# EAGLE schematic simple (EAGLE 7.7.0)
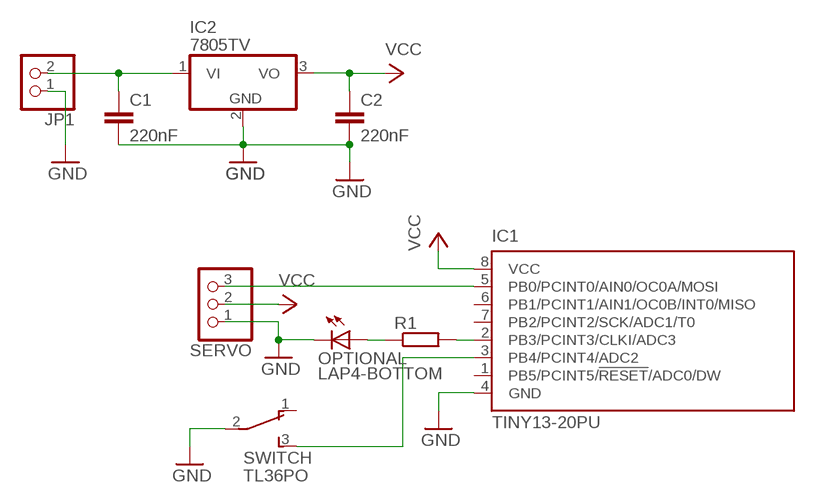
[diagram p0: schematic, sheet 1]

## Parts
C1  220nF  C-EU025-050X050  [C025-050X050]
C2  220nF  C-EU025-050X050  [C025-050X050]
IC1  TINY13-20PU  [DIL08]
IC2  7805TV  [TO220V]
JP1  PINHD-1X2  [1X02]
OPTIONAL  LAP4-BOTTOM  [P47F-BOTTOM]
R1  R-EU_0411/3V  [0411V]
SERVO  PINHD-1X3  [1X03]
SWITCH  TL36PO  [TL3XPO]

## Nets
GND: C1.2 C2.2 IC1.4(GND) IC2.2(GND) OPTIONAL.C SERVO.1 SWITCH.2(P)
N$1: IC1.5(PB0/PCINT0/AIN0/OC0A/MOSI) SERVO.3
N$2: IC1.3(PB4/PCINT4/ADC2) SWITCH.3(S)
N$3: OPTIONAL.A R1.1
N$4: IC1.2(PB3/PCINT3/CLKI/ADC3) R1.2
N$5: C1.1 IC2.1(VI) JP1.2
N$6: JP1.1
VCC: C2.1 IC1.8(VCC) IC2.3(VO) SERVO.2
Unconnected: IC1.1(PB5/PCINT5/!RESET!/ADC0/DW) IC1.6(PB1/PCINT1/AIN1/OC0B/INT0/MISO) IC1.7(PB2/PCINT2/SCK/ADC1/T0) SWITCH.1(O)

## Library data of the parts
C1 C2 = rcl:C-EU: CAPACITOR, European symbol
IC1 = atmel:TINY13: 8-bit AVR Microcontroller with 1K Bytes In-System Programmable Flash Source: http://www.atmel.com/dyn/resources/prod_documents/2535S.pdf; MPN: ATTINY13-20PU; OC_FARNELL: 9171550; OC_NEWARK: 96K6521
IC2 = linear:78*: Positive VOLTAGE REGULATOR Source: http://cache.national.com/ds/LM/LM78L05.pdf http://www.fairchildsemi.com/ds/LM/LM7805.pdf
JP1 = pinhead:PINHD-1X2: PIN HEADER
OPTIONAL = led:*P4: PointLED® Enhanced Thinfilm LED TOP & BOTTOM mount LS P47F, LR P47F, LA P47F, LY P47F, LT P4SG, LB P4SG, LW P4SG Source: http://catalog.osram-os.com .. LA_LR_LS_LY_P47F_Pb_free.pdf
R1 = rcl:R-EU_: RESISTOR, European symbol
SERVO = pinhead:PINHD-1X3: PIN HEADER
SWITCH = switch:TL36PO: TINY SWITCH ON - ON Source: http://www2.produktinfo.conrad.com/datenblaetter/700000-724999/705152-da-01-de-Subminiaturschalter_TL_36YO.pdf